# Altium schematic sheet user_interfaces.SchDoc
size A4; SheetNumber: 5; SheetTotal: 5
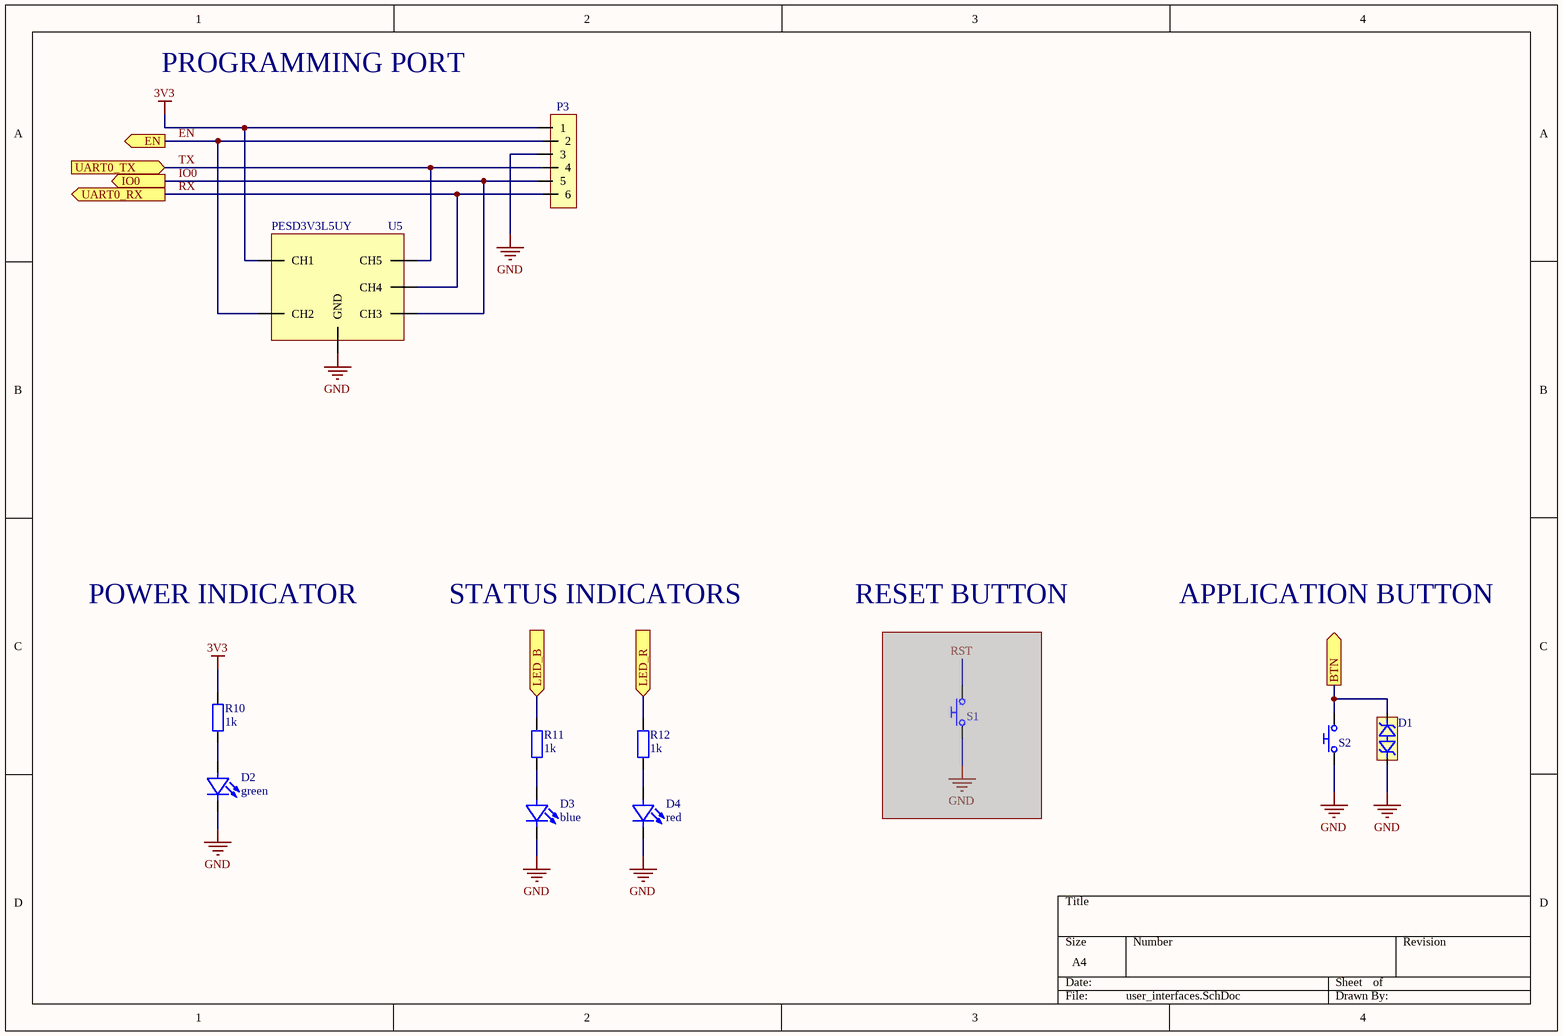
[diagram p0: user_interfaces.SchDoc]

## Parts
D1  CDSOD323-T03SC  [diode_smd_sod_323-2]  (value not drawn)
D2  green  [led_smd_0603]
D3  blue  [led_smd_0603]
D4  red  [led_smd_0603]
P3  Header  [header_2X3_2mm54]  (value not drawn)
R10  1k  [resisitor_smd_0603]
R11  1k  [resisitor_smd_0603]
R12  1k  [resisitor_smd_0603]
S1  value  [tactile_switch_smd_6x6mm_5mm_4_pin]  (value not drawn)  (masked out: inside a compile mask, not in the netlist)
S2  Tactile switch  [tactile_switch_smd_6x6mm_5mm_4_pin]  (value not drawn)
U5  PESD3V3L5UY  [GENERIC_SOT363]

## Ports
BTN (out, see LEDcontroller[3C], microcontroller[2B]), EN (out, see LEDcontroller[3C], microcontroller[1B]), IO0 (out, see LEDcontroller[3C], microcontroller[3B]), LED_B (in, see LEDcontroller[3C], microcontroller[2B]), LED_R (in, see LEDcontroller[3C], microcontroller[2B]), UART0_RX (out, see LEDcontroller[3B], microcontroller[3B]), UART0_TX (in, see LEDcontroller[3B], microcontroller[3B])

## Nets
3V3: P3.1 R10.1 U5.1(CH1)
GND: D1.2 D2.2 D3.2 D4.2 P3.3 S2.1 U5.2(GND)
BTN: D1.1 S2.2 ; port BTN
EN: P3.2 U5.3(CH2) ; port EN
IO0: P3.5 U5.4(CH3) ; port IO0
LED_B: R11.1 ; port LED_B
LED_R: R12.1 ; port LED_R
RX: P3.6 U5.5(CH4) ; port UART0_RX
TX: P3.4 U5.6(CH5) ; port UART0_TX
NetD2_1: D2.1 R10.2
NetD3_1: D3.1 R11.2
NetD4_1: D4.1 R12.2

## Notes on the sheet
- PROGRAMMING PORT
- POWER INDICATOR
- STATUS INDICATORS
- RESET BUTTON
- APPLICATION BUTTON

## Library data of the parts
D1 = ESD diode: Bourns CDSOD323-T03SC
D2 = LED: Osram KG EELP41.22-PHRH-35-A8J8-20-R18
D3 = LED: ROHM SMLEN3BC8TT86
D4 = LED: Osram KS EELP41.22-P1R2-58-A8J8-020-R18
P3 = Header 2X3
R10-R12 = Resistor: Vishay CRCW06031K00FKED
S1 = Switch - 4 pins V2: pin to pad: 1>1+3 2>2+4
S2 = Switch - 4 pins V2: Same Sky TS04-66-43-BK-160-SMT; pin to pad: 1>1+3 2>2+4
U5 = ESD diodes - 5 channels: Nexperia PESD3V3L5UY,115